# EAGLE design riffleito-xbee-REVA (EAGLE 6.5.0)
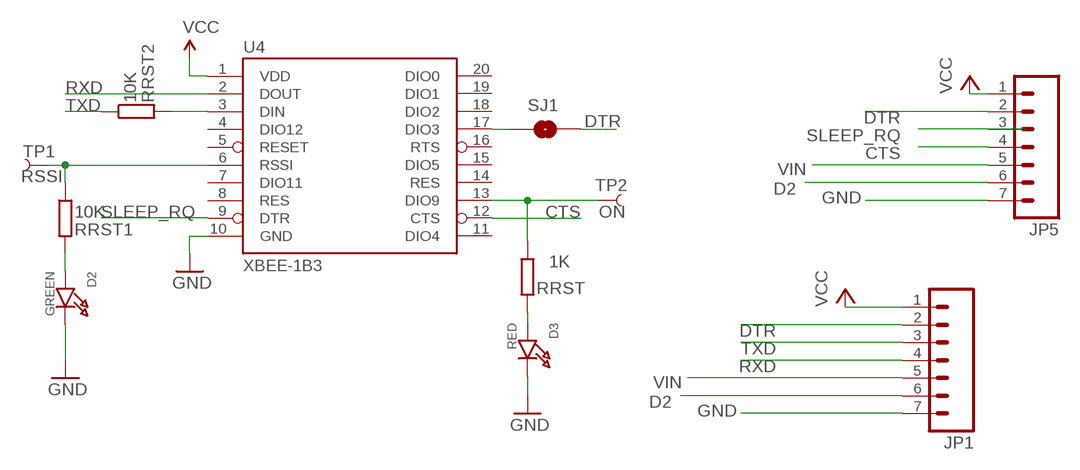
[diagram p0: schematic, sheet 1]

## Parts
D2  GREEN  LED0805  [CHIPLED_0805]
D3  RED  LED0805  [CHIPLED_0805]
JP1  M07  [1X07]
JP5  M07  [1X07]
RRST  1K  R-EU_R0805  [R0805]
RRST1  10K  R-EU_R0805  [R0805]
RRST2  10K  R-EU_R0805  [R0805]
SJ1  SOLDERJUMPERNC  [SJ_2S]
TP1  RSSI  TEST-POINT3X5  [PAD.03X.05]
TP2  ON  TEST-POINT3X5  [PAD.03X.05]
U4  XBEE-1B3  [XBEE-SMD]

## Nets
CTS: JP5.4 U4.12(CTS)
D2: JP1.6 JP5.6
DTR: JP1.2 JP5.2 SJ1.2
GND: D2.C D3.C JP1.7 JP5.7 U4.10(GND)
N$1: RRST.1 TP2.P$1 U4.13(DIO9)
N$3: D2.A RRST1.2
N$4: RRST1.1 TP1.P$1 U4.6(RSSI)
N$6: D3.A RRST.2
N$7: RRST2.2 U4.3(DIN)
N$13: SJ1.1 U4.17(DIO3)
RXD: JP1.4 U4.2(DOUT)
SLEEP_RQ: JP5.3 U4.9(DTR)
TXD: JP1.3 RRST2.1
VCC [power]: JP1.1 JP5.1 U4.1(VDD)
VIN [power]: JP1.5 JP5.5
Unconnected: U4.4(DIO12) U4.5(RESET) U4.7(DIO11) U4.8(RES) U4.11(DIO4) U4.14(RES) U4.15(DIO5) U4.16(RTS) U4.18(DIO2) U4.19(DIO1) U4.20(DIO0)

## Library data of the parts
D2 D3 = microbuilder:LED: LED 0603 - 0603 Surface Mount Package 2mA: Green LED - Low Power (3.9mcd, 2ma, 1.7Vf) - Digikey: 475-2709-2-ND Orange LED - Low Power (9.8mcd, 2ma, 1.8Vf) - Digikey: 475-1194-2-ND Red LED - Low Power (5mcd, 2ma, 1.8Vf) - Digikey: 475-1195-2-ND Yellow LED - Low Power (7mcd, 2ma, 1.8Vf) - Digikey: 475-1196-2-ND 5mA: Blue LED - Low Power (17mcd, 5ma, 2.9Vf) - Digikey: LNJ937W8CRACT-ND 0805 - 0805 Surface Mount Package 2mA: Red LED (8.8mcd, 2mA, 1.8Vf, Clear) - Low Power [Digikey: 475-2510-1-ND] Green LED (5mcd, 2mA, 1.8Vf, Clear) - Low Power [Digikey: 475-2730-1-ND] Yellow LED (11.3mcd, 2mA, 1.8Vf, Clear) - Low Power [Digikey: 475-2555-1-ND] 20mA: Red LED (104mcd, 20mA, Diffused) - LS R976 [Digikey: 475-1278-6-ND] Red LED (12mcd, 20mA, 2.0Vf, Clear) - APT2012EC [Digikey: 754-1128-1-ND] Green LED (15mcd, 20mA, 2.2Vf, Clear) - APT2012GC [Digikey: 754-1131-1-ND] Orange LED (160mcd, 20mA, 2.1Vf, Clear) - APT2012SECK [Digikey: 754-1130-1-ND] 1206 - 1206 Surface Mount Package Green LED (26mcd, 20mA, Diffused) - LG N971 [Digikey: 475-1407-6-ND] Red LED (15mcd, 20mA, Diffused) - LH N974 [Digikey: 475-1416-6-ND]
JP1 JP5 = SparkFun-Connectors:M07: Header 7 Standard 7-pin 0.1" header. Use with straight break away headers (SKU : PRT-00116), right angle break away headers (PRT-00553), swiss pins (PRT-00743), machine pins (PRT-00117), and female headers (PRT-00115). NOTES ON THE VARIANTS LOCK and LOCK_LONGPADS... This footprint was designed to help hold the alignment of a through-hole component (i.e. 7-pin header) while soldering it into place. You may notice that each hole has been shifted either up or down by 0.005 of an inch from it's more standard position (which is usually a perfectly straight line). This slight alteration caused the pins (the squares in the middle) to touch the edges of the holes. Because they are alternating, it causes a "brace" to hold the header in place. 0.005 has proven to be the perfect amount of "off-center" position when using our standard breakaway headers. Although looks a little odd when you look at the bare footprint, once you have a header in there, the alteration is very hard to notice. Also, if you push a header all the way into place, it is covered up entirely on the bottom side. This idea of altering the position of holes to aid alignment will be further integrated into the Sparkfun Library for other footprints. It can help hold any component with 3 or more connection pins.
RRST RRST1 RRST2 = rcl:R-EU_: RESISTOR, European symbol
SJ1 = SparkFun:SOLDERJUMPER: Solder Jumper Standard SMD solder jumper. Used to automate production. Two varients : Normally Open and Normally Closed are the same, but have different paste layers. NC will have a large amount of paste and should jumper during reflow.
TP1 TP2 = SparkFun:TEST-POINT
U4 = SparkFun:XBEE-1

## Net classes
0 default: width 0.203 mm, drill 0.33 mm, clearance 0.203 mm
1 power: width 0.381 mm, drill 0.33 mm, clearance 0.254 mm

## Board
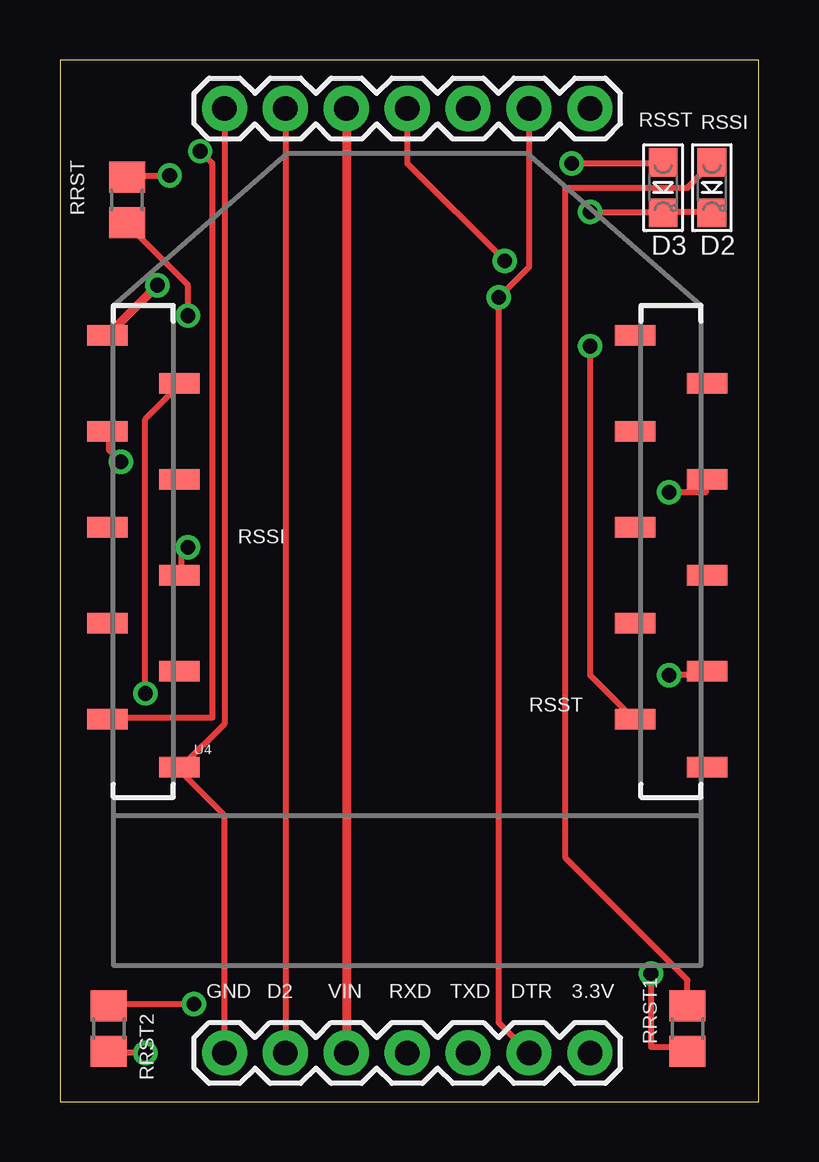
[diagram p1: board, top side]
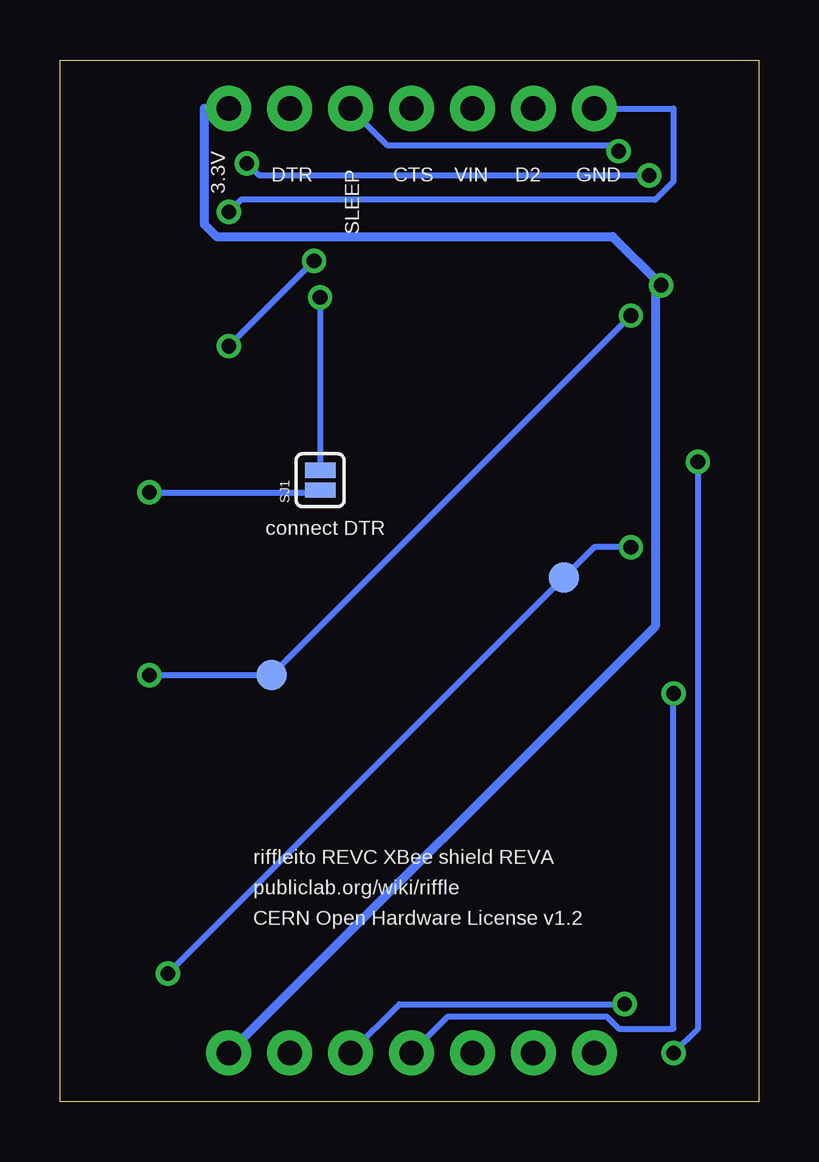
[diagram p2: board, bottom side, seen from below]

Size 29.13 x 43.42 mm. Coordinates in mm from the lower left corner, seen from the top.
Outline: 0,0 29.13,0 29.13,43.42 0,43.42 0,0
Copper layers (1*16): Top 0.035mm / dielectric 1.5mm / Bottom 0.035mm
Design rules "default": minimum track width 10mil, minimum drill 24mil, track to track 8mil, track to pad 8mil, pad to pad 8mil, via to via 8mil, smd to smd 8mil, copper to edge 40mil, drill to drill 8mil, minimum pad ring 10mil, minimum via ring 8mil, stop-mask expansion 4mil, vias tented up to drill 0mil, thermal gap 10mil

### Footprints (pad centres in the part's own frame; a part is rotated, then mirrored left to right if it is on the bottom)
CHIPLED_0805 = smd 1.2 x 1.2: A 0,-1.05; C 0,1.05
1X07 = drill 1.016 pad 1.88: 1 0,0; 2 2.54,0; 3 5.08,0; 4 7.62,0; 5 10.16,0; 6 12.7,0; 7 15.24,0
R0805 = smd 1.3 x 1.5: 1 -0.95,0; 2 0.95,0
SJ_2S = smd 0.635 x 1.27: 1 -0.412,0; 2 0.412,0
PAD.03X.05 = smd 1.27 x 1.27: P$1 0,0
XBEE-SMD = smd 1.7 x 0.85: 1 -12.5,20; 2 -9.5,18; 3 -12.5,16; 4 -9.5,14; 5 -12.5,12; 6 -9.5,10; 7 -12.5,8; 8 -9.5,6; 9 -12.5,4; 10 -9.5,2; 11 12.5,2; 12 9.5,4; 13 12.5,6; 14 9.5,8; 15 12.5,10; 16 9.5,12; 17 12.5,14; 18 9.5,16; 19 12.5,18; 20 9.5,20

### Placement (x,y rotation side)
D2  27.18,38.1 180 top
D3  25.15,38.1 180 top
JP1  22.1,2.03 180 top
JP5  22.1,41.4 180 top
RRST  2.79,37.59 90 top
RRST1  26.16,3.05 90 top
RRST2  2.03,3.05 270 top
SJ1  18.29,25.91 90 bottom
TP1  8.13,21.84 0 bottom
TP2  20.32,17.78 0 bottom
U4  14.48,11.94 0 top

### Tracks (layer width: path | path; a pad name or v marks a point on that pad's centre or on a via)
CTS  (via drill 0.61)
  Top 0.254: v22.1,31.5 22.1,17.78 23.88,16 U4.12 | v18.54,35.05 14.48,39.12 JP5.4
  Bottom 0.254: v18.54,35.05 v22.1,31.5
D2
  Top 0.254: JP5.6 JP1.6
DTR  (via drill 0.61)
  Top 0.254: JP5.2 19.56,34.8 v18.29,33.53 18.29,3.3 JP1.2
  Bottom 0.254: v18.29,33.53 SJ1.2
GND  (via drill 0.61)
  Top 0.254: JP1.7 6.86,11.94 5.08,13.72 U4.10 5.08,13.97 6.86,15.75 JP5.7 | 25.15,37.08 27.18,37.08 D2.C | v22.1,37.08 25.15,37.08 | 25.15,37.08 D3.C
  Bottom 0.254: v22.1,37.08 21.59,37.59 4.32,37.59 3.56,38.35 3.56,41.4 JP5.7
N$1  (via drill 0.61)
  Top 0.254: v25.4,17.78 26.92,17.78 U4.13 | v5.33,32.77 5.33,34.04 2.79,36.58 RRST.1
  Bottom 0.254: v25.4,17.78 TP2.P$1 v5.33,32.77
N$3
  Top 0.254: RRST1.2 26.16,5.08 21.08,10.16 21.08,38.1 26.16,38.1 27.18,39.12 D2.A
N$4  (via drill 0.61)
  Top 0.254: v5.33,23.11 5.08,22.86 5.08,22.1 U4.6 | v24.64,5.33 24.64,2.29 26.16,2.29 RRST1.1
  Bottom 0.254: v5.33,23.11 6.86,23.11 TP1.P$1 v24.64,5.33
N$6  (via drill 0.61)
  Top 0.254: v21.34,39.12 25.15,39.12 D3.A | v4.57,38.61 2.79,38.61 RRST.2
  Bottom 0.254: v21.34,39.12 20.83,38.61 v4.57,38.61
N$7  (via drill 0.61)
  Top 0.254: v3.56,2.03 2.03,2.03 RRST2.2 | v2.54,26.67 2.03,27.18 2.03,27.69 U4.3
  Bottom 0.254: v3.56,2.03 2.54,3.05 v2.54,26.67
N$13  (via drill 0.61)
  Top 0.254: v25.4,25.4 26.92,25.4 26.92,25.91 U4.17
  Bottom 0.254: v25.4,25.4 18.29,25.4 SJ1.1
RXD  (via drill 0.61)
  Top 0.254: v3.56,17.02 3.56,28.45 4.83,29.72 U4.2
  Bottom 0.254: v3.56,17.02 3.56,3.05 5.84,3.05 6.35,3.56 12.95,3.56 JP1.4
SLEEP_RQ  (via drill 0.61)
  Top 0.254: v5.84,39.62 6.35,39.12 6.35,16 2.03,16 U4.9
  Bottom 0.254: v5.84,39.62 6.1,39.88 15.49,39.88 JP5.3
TXD  (via drill 0.61)
  Top 0.254: v5.59,4.06 2.03,4.06 RRST2.1
  Bottom 0.254: v5.59,4.06 14.99,4.06 JP1.3
VCC  (via drill 0.61)
  Top 0.381: v4.06,34.04 2.03,32 U4.1
  Bottom 0.381: JP5.1 23.11,41.4 23.11,36.58 22.61,36.07 6.1,36.07 v4.06,34.04 4.32,34.04 4.32,19.81 JP1.1
VIN
  Top 0.381: JP5.5 JP1.5

### Text on the board
tPlace: RSSI | RSST | RSSI | RSST | GND | D2 | VIN | RXD | TXD | DTR | 3.3V
bPlace: 3.3V | GND | D2 | VIN | CTS | SLEEP | DTR | connect DTR | riffleito REVC XBee shield REVA | publiclab.org/wiki/riffle | CERN Open Hardware License v1.2